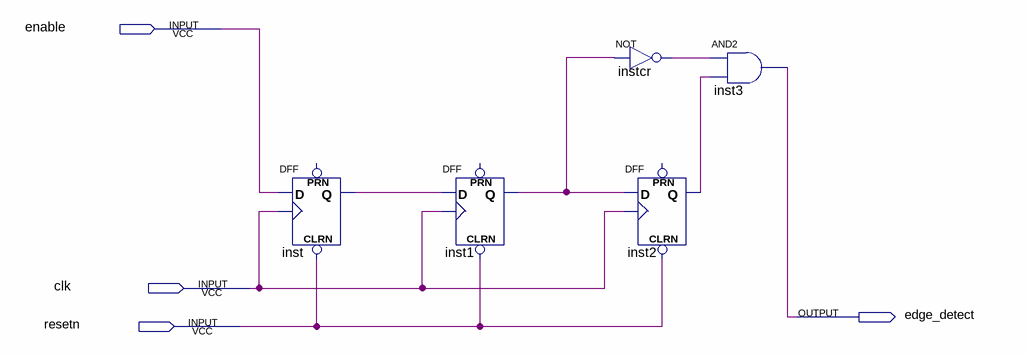
[diagram p0: schematic sheet]
// Quartus schematic edge_detect.bdf as structural Verilog: 5 symbols, 4 pins
module edge_detect (
  input  enable,
  input  clk,
  input  resetn,
  output edge_detect
);

  wire inst1_q, inst2_q, inst_q, instcr_out;

  DFF inst (.CLRN(resetn), .CLK(clk), .D(enable), .Q(inst_q));  // open: PRN
  DFF inst1 (.CLRN(resetn), .CLK(clk), .D(inst_q), .Q(inst1_q));  // open: PRN
  not instcr (instcr_out, inst1_q);
  DFF inst2 (.CLRN(resetn), .CLK(clk), .D(inst1_q), .Q(inst2_q));  // open: PRN
  and inst3 (edge_detect, instcr_out, inst2_q);
endmodule
